# Altium schematic sheet Muxes_and_ADC.SchDoc: Multiplexers_and_ADC
size 431 x 279 mm; DrawnBy: Will Mensah; Organization: ORGANIZATION; Address1: ADDRESS 1; Address2: ADDRESS 2; Address3: ADDRESS 3; Address4: ADDRESS 4; Revision: -; SheetNumber: 4; SheetTotal: 6; ENG_APP_DATE: --/--/--; DSN_APP_DATE: --/--/--; CHK_APP_DATE: --/--/--
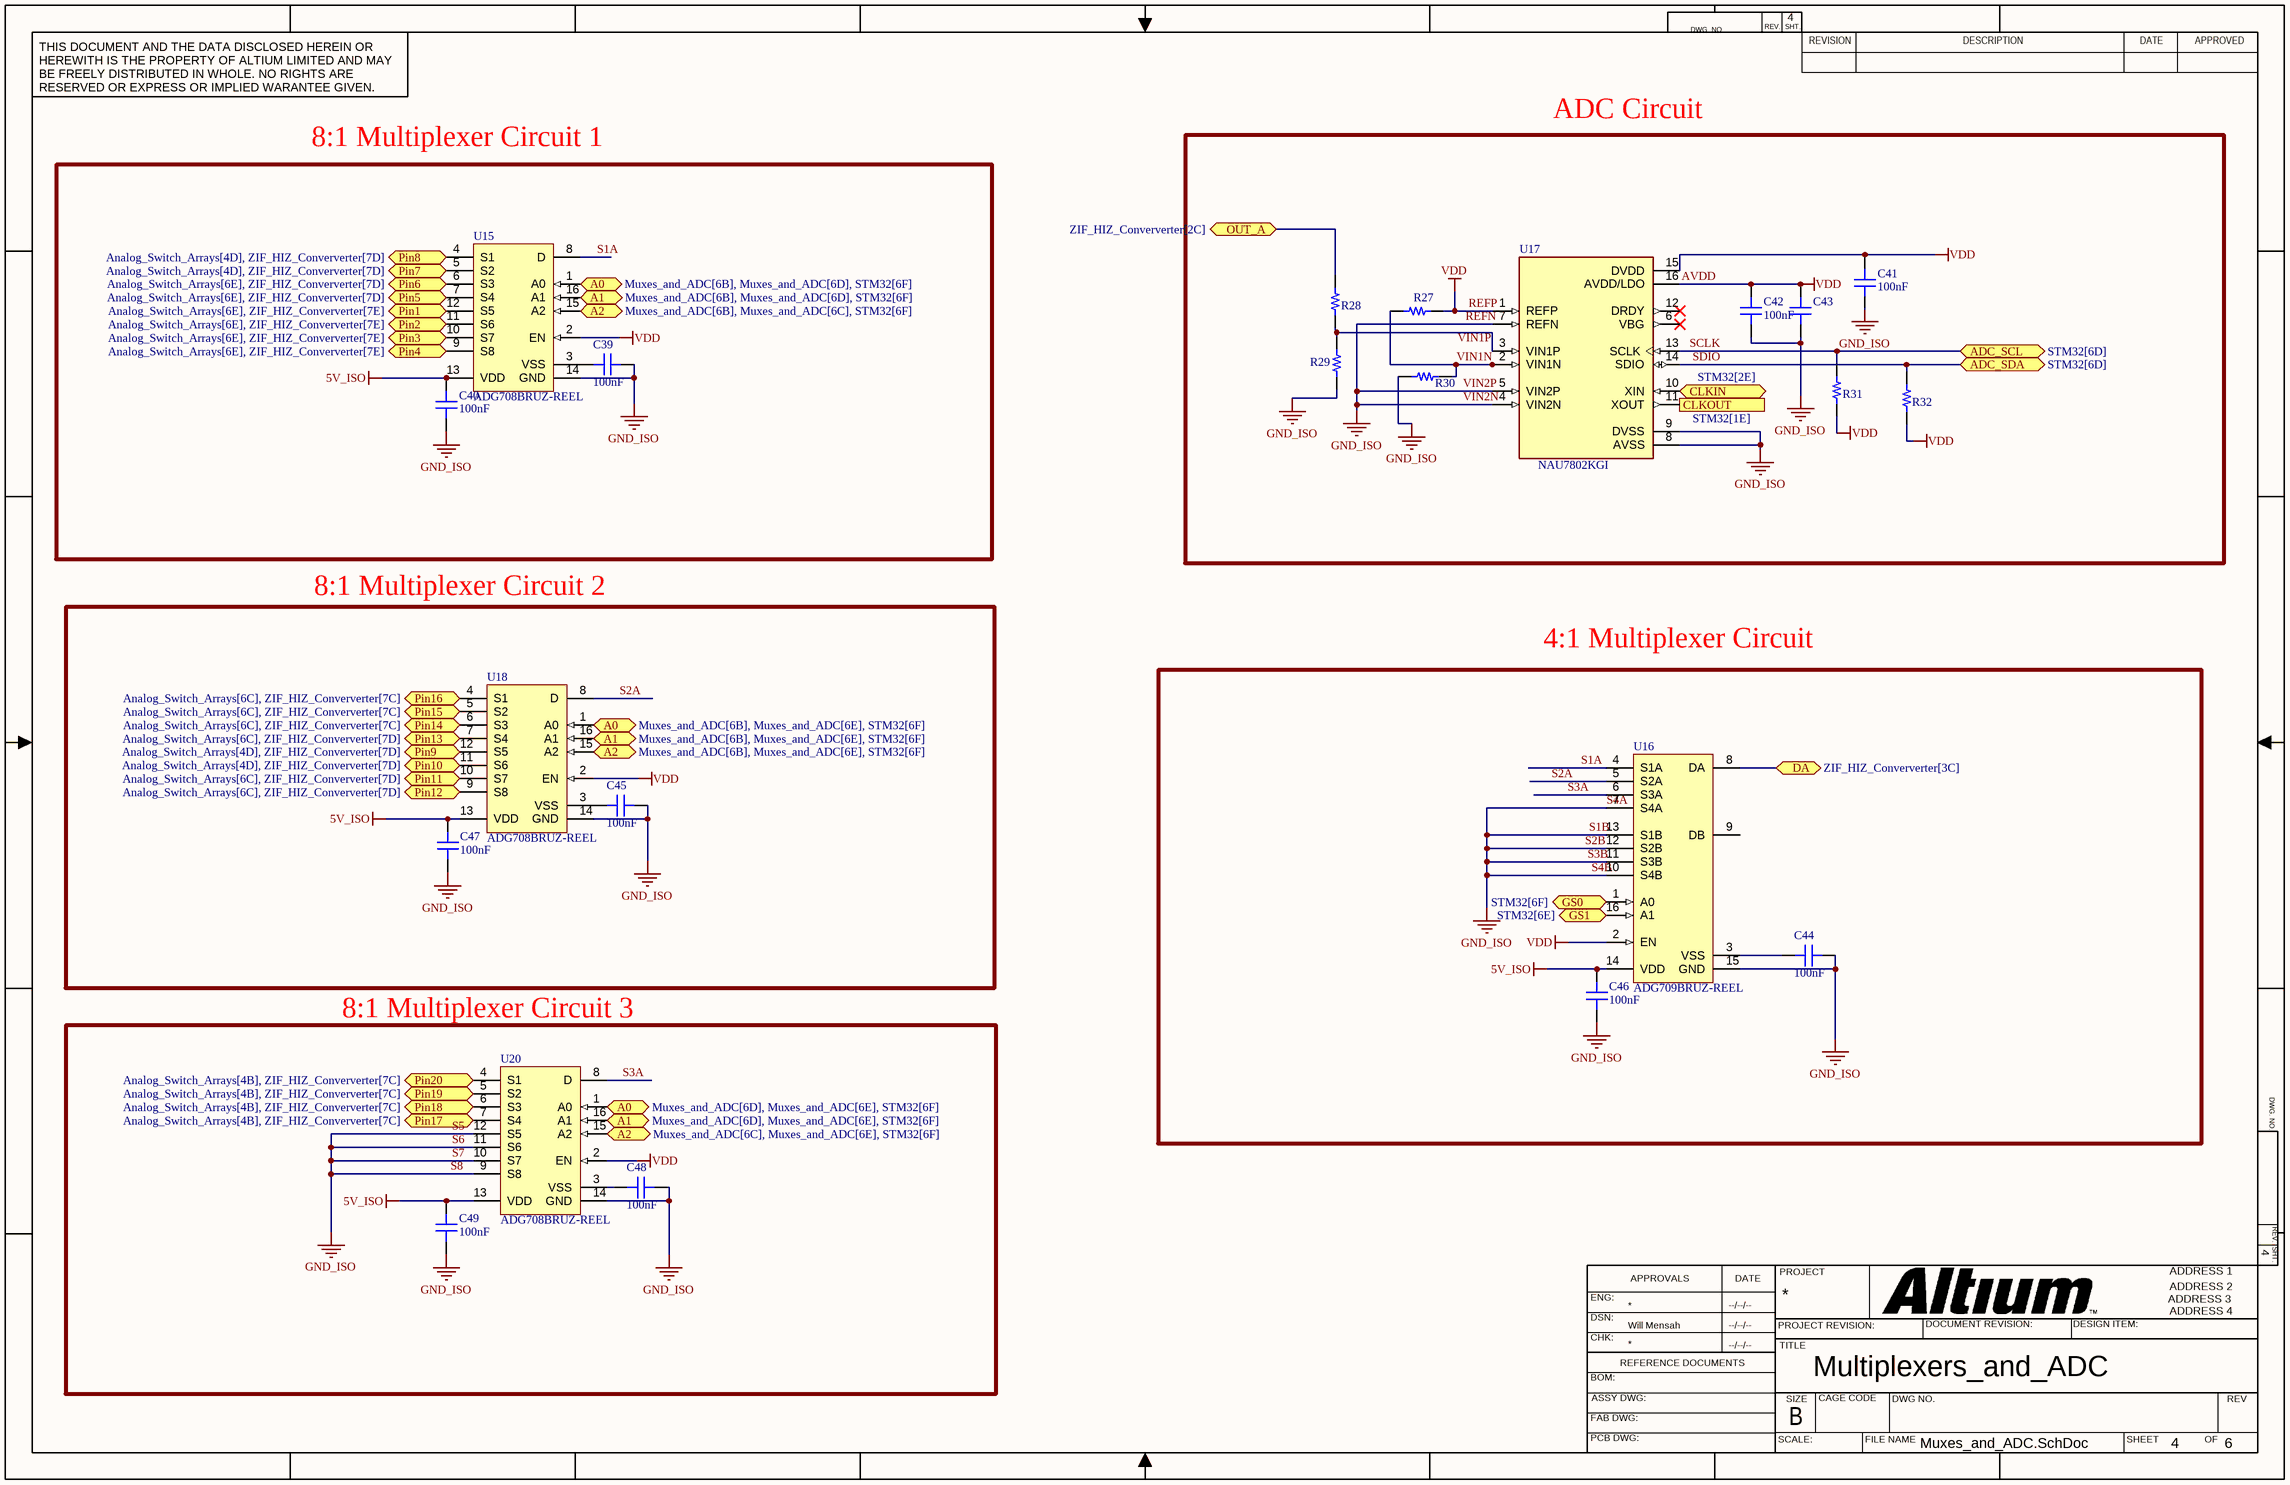
[diagram p0: Muxes_and_ADC.SchDoc]

## Parts
C39  value 100nF  [CAP 1206_3216 - 0.8MM]  (hidden comment: C1206X104G4HAC7800)
C40  value 100nF  [CAP 1206_3216 - 0.8MM]  (hidden comment: C1206X104G4HAC7800)
C41  value 100nF  [CAP 1206_3216 - 0.8MM]  (hidden comment: C1206X104G4HAC7800)
C42  value 100nF  [CAP 1206_3216 - 0.8MM]  (hidden comment: C1206X104G4HAC7800)
C43  C1206X104G4HAC7800  [CAP 1206_3216 - 0.8MM]  (value not drawn)
C44  value 100nF  [CAP 1206_3216 - 0.8MM]  (hidden comment: C1206X104G4HAC7800)
C45  value 100nF  [CAP 1206_3216 - 0.8MM]  (hidden comment: C1206X104G4HAC7800)
C46  value 100nF  [CAP 1206_3216 - 0.8MM]  (hidden comment: C1206X104G4HAC7800)
C47  value 100nF  [CAP 1206_3216 - 0.8MM]  (hidden comment: C1206X104G4HAC7800)
C48  value 100nF  [CAP 1206_3216 - 0.8MM]  (hidden comment: C1206X104G4HAC7800)
C49  value 100nF  [CAP 1206_3216 - 0.8MM]  (hidden comment: C1206X104G4HAC7800)
R27  TNPW120610K0BETY  [RES 1206_3216]  (value not drawn)
R28  TNPW120610K0BETY  [RES 1206_3216]  (value not drawn)
R29  TNPW120620K0BYEN  [RES 1206_3216]  (value not drawn)
R30  TNPW120610K0BETY  [RES 1206_3216]  (value not drawn)
R31  TNPW12064K70BEEA  [RES 1206_3216]  (value not drawn)
R32  TNPW12064K70BEEA  [RES 1206_3216]  (value not drawn)
U15  ADG708BRUZ-REEL  [ADI-RU-16_N]
U16  ADG709BRUZ-REEL  [ADI-RU-16_M]
U17  NAU7802KGI  [DIP792W45P254L1904H533Q16]
U18  ADG708BRUZ-REEL  [ADI-RU-16_N]
U20  ADG708BRUZ-REEL  [ADI-RU-16_N]

## Blocks framed on the sheet
8:1 Multiplexer Circuit 1: C39 C40 U15
ADC Circuit: C41-C43 R27-R32 U17
8:1 Multiplexer Circuit 2: C45 C47 U18
4:1 Multiplexer Circuit: C44 C46 U16
8:1 Multiplexer Circuit 3: C48 C49 U20

## Ports
A0 (bidir, see Muxes_and_ADC[6B], Muxes_and_ADC[6D], STM32[6F]), A0 (bidir, see Muxes_and_ADC[6B], Muxes_and_ADC[6E], STM32[6F]), A0 (bidir, see Muxes_and_ADC[6D], Muxes_and_ADC[6E], STM32[6F]), A1 (bidir, see Muxes_and_ADC[6B], Muxes_and_ADC[6D], STM32[6F]), A1 (bidir, see Muxes_and_ADC[6B], Muxes_and_ADC[6E], STM32[6F]), A1 (bidir, see Muxes_and_ADC[6D], Muxes_and_ADC[6E], STM32[6F]), A2 (bidir, see Muxes_and_ADC[6B], Muxes_and_ADC[6C], STM32[6F]), A2 (bidir, see Muxes_and_ADC[6B], Muxes_and_ADC[6E], STM32[6F]), A2 (bidir, see Muxes_and_ADC[6C], Muxes_and_ADC[6E], STM32[6F]), ADC_SCL (bidir, see STM32[6D]), ADC_SDA (bidir, see STM32[6D]), CLKIN (bidir, see STM32[2E]), CLKOUT (out, see STM32[1E]), DA (bidir, see ZIF_HIZ_Conververter[3C]), GS0 (bidir, see STM32[6F]), GS1 (bidir, see STM32[6E]), OUT_A (bidir, see ZIF_HIZ_Conververter[2C]), Pin1 (bidir, see Analog_Switch_Arrays[6E], ZIF_HIZ_Conververter[7E]), Pin2 (bidir, see Analog_Switch_Arrays[6E], ZIF_HIZ_Conververter[7E]), Pin3 (bidir, see Analog_Switch_Arrays[6E], ZIF_HIZ_Conververter[7E]), Pin4 (bidir, see Analog_Switch_Arrays[6E], ZIF_HIZ_Conververter[7E]), Pin5 (bidir, see Analog_Switch_Arrays[6E], ZIF_HIZ_Conververter[7D]), Pin6 (bidir, see Analog_Switch_Arrays[6E], ZIF_HIZ_Conververter[7D]), Pin7 (bidir, see Analog_Switch_Arrays[4D], ZIF_HIZ_Conververter[7D]), Pin8 (bidir, see Analog_Switch_Arrays[4D], ZIF_HIZ_Conververter[7D]), Pin9 (bidir, see Analog_Switch_Arrays[4D], ZIF_HIZ_Conververter[7D]), Pin10 (bidir, see Analog_Switch_Arrays[4D], ZIF_HIZ_Conververter[7D]), Pin11 (bidir, see Analog_Switch_Arrays[6C], ZIF_HIZ_Conververter[7D]), Pin12 (bidir, see Analog_Switch_Arrays[6C], ZIF_HIZ_Conververter[7D]), Pin13 (bidir, see Analog_Switch_Arrays[6C], ZIF_HIZ_Conververter[7D]), Pin14 (bidir, see Analog_Switch_Arrays[6C], ZIF_HIZ_Conververter[7C]), Pin15 (bidir, see Analog_Switch_Arrays[6C], ZIF_HIZ_Conververter[7C]), Pin16 (bidir, see Analog_Switch_Arrays[6C], ZIF_HIZ_Conververter[7C]), Pin17 (bidir, see Analog_Switch_Arrays[4B], ZIF_HIZ_Conververter[7C]), Pin18 (bidir, see Analog_Switch_Arrays[4B], ZIF_HIZ_Conververter[7C]), Pin19 (bidir, see Analog_Switch_Arrays[4B], ZIF_HIZ_Conververter[7C]), Pin20 (bidir, see Analog_Switch_Arrays[4B], ZIF_HIZ_Conververter[7C])

## Nets
5V_ISO: C40.2 C46.1 C47.1 C49.1 U15.13(VDD) U16.14(VDD) U18.13(VDD) U20.13(VDD)
AVDD: C41.1 C42.1 C43.1 R27.1 R31.1 R32.1 U15.2(EN) U16.2(EN) U17.1(REFP) U17.15(DVDD) U17.16(AVDD/LDO) U18.2(EN) U20.2(EN)  [also labelled REFP, VDD]
REFN: C39.1 C40.1 C41.2 C42.2 C43.2 C44.1 C45.1 C46.2 C47.2 C48.1 C49.2 R29.1 R30.2 U15.14(GND) U16.7(S4A) U16.10(S4B) U16.11(S3B) U16.12(S2B) U16.13(S1B) U16.15(GND) U17.4(VIN2N) U17.5(VIN2P) U17.7(REFN) U17.8(AVSS) U17.9(DVSS) U18.14(GND) U20.9(S8) U20.10(S7) U20.11(S6) U20.12(S5) U20.14(GND)  [also labelled GND_ISO, S1B, S2B, S3B, S4A, S4B, S5, S6, S7, S8, VIN2N, VIN2P]
A0: U15.1(A0) U18.1(A0) U20.1(A0) ; port A0
A1: U15.16(A1) U18.16(A1) U20.16(A1) ; port A1
A2: U15.15(A2) U18.15(A2) U20.15(A2) ; port A2
CLKIN: U17.10(XIN) ; port CLKIN
CLKOUT: U17.11(XOUT) ; port CLKOUT
DA: U16.8(DA) ; port DA
GS0: U16.1(A0) ; port GS0
GS1: U16.16(A1) ; port GS1
OUT_A: R28.2 ; port OUT_A
Pin1: U15.12(S5) ; port Pin1
Pin2: U15.11(S6) ; port Pin2
Pin3: U15.10(S7) ; port Pin3
Pin4: U15.9(S8) ; port Pin4
Pin5: U15.7(S4) ; port Pin5
Pin6: U15.6(S3) ; port Pin6
Pin7: U15.5(S2) ; port Pin7
Pin8: U15.4(S1) ; port Pin8
Pin9: U18.12(S5) ; port Pin9
Pin10: U18.11(S6) ; port Pin10
Pin11: U18.10(S7) ; port Pin11
Pin12: U18.9(S8) ; port Pin12
Pin13: U18.7(S4) ; port Pin13
Pin14: U18.6(S3) ; port Pin14
Pin15: U18.5(S2) ; port Pin15
Pin16: U18.4(S1) ; port Pin16
Pin17: U20.7(S4) ; port Pin17
Pin18: U20.6(S3) ; port Pin18
Pin19: U20.5(S2) ; port Pin19
Pin20: U20.4(S1) ; port Pin20
S1A: U15.8(D) U16.4(S1A)
S2A: U16.5(S2A) U18.8(D)
S3A: U16.6(S3A) U20.8(D)
SCLK: R31.2 U17.13(SCLK) ; port ADC_SCL
SDIO: R32.2 U17.14(SDIO) ; port ADC_SDA
VIN1N: R27.2 R30.1 U17.2(VIN1N)
NetC39_2: C39.2 U15.3(VSS)
NetC44_2: C44.2 U16.3(VSS)
NetC45_2: C45.2 U18.3(VSS)
NetC48_2: C48.2 U20.3(VSS)
NetR28_1: R28.1 R29.2 U17.3(VIN1P)

Not connected (* = marked no-connect by the designer): U16 9(DB); U17 6(VBG)* 12(DRDY)*

## Notes on the sheet
- Labels drawn without touching a wire or pin: VIN1P
- DWG. NO.
- REV.
- SHT.
- THIS DOCUMENT AND THE DATA DISCLOSED HEREIN OR HEREWITH IS THE PROPERTY OF ALTIUM LIMITED AND MAY BE FREELY DISTRIBUTED IN WHOLE. NO RIGHTS ARE RESERVED OR EXPRESS OR IMPLIED WARANTEE GIVEN.
- REVISION
- DESCRIPTION
- DATE
- APPROVED
- ENG:
- APPROVALS
- PROJECT
- DSN:
- CHK:
- REFERENCE DOCUMENTS
- PROJECT REVISION:
- TITLE
- DOCUMENT REVISION:
- DESIGN ITEM:
- BOM:
- FAB DWG:
- PCB DWG:
- ASSY DWG:
- SCALE:
- SIZE
- B
- CAGE CODE
- FILE NAME
- DWG NO.
- SHEET
- OF
- REV

## Library data of the parts
C39-C49 = CMP-001-063573-1: CAP CER 1206 0.1F 16V ULTRA STAB; Part Number: C1206X104G4HAC7800
R27 R28 R30 = CMP-009-078908-1: RES 10K OHM 0.1% 1/4W 1206; Part Number: TNPW120610K0BETY
R29 = CMP-009-083572-1: RES 20K OHM 0.1% 1/4W 1206; Part Number: TNPW120620K0BYEN
R31 R32 = CMP-009-078373-1: RES 4.7K OHM 0.1% 1/4W 1206; Part Number: TNPW12064K70BEEA
U15 U18 U20 = CMP-0798-00195-1: 1.8 to 5.5 V / +/-2.5 V, CMOS Low Voltage 3 Ohm, 8-Channel Multiplexer, -40 to 125 degC, 16-pin SOP (RU-16), Reel; Manufacturer: Analog Devices; t transition (s): 14n; Bandwidth (Hz): 55M; Supply V Guar Performance: Dual_(+/-2.5V), Single_(+3V), Single_(+5V); Ron (ohms): 3; Max Analog Signal Range: Vss to Vdd; ComponentLink1URL: http://www.analog.com/en/index.html; ComponentLink3Description: Package Specification; Code_JEDEC: MO-153AB; ComponentLink2URL: http://www.analog.com/static/imported-files/data_sheets/ADG708_709.pdf; Packing: Reel; ComponentLink3URL: http:/www.analog.com/static/imported-files/packages/36244347913743854010197452789RU16.pdf; PackageVersion: Nov-02; ComponentLink2Description: Datasheet; ComponentLink1Description: Manufacturer URL; PackageReference: RU-16; DatasheetVersion: Rev. C; PackageDescription: 16-Pin Thin Shrink Small Outline Package, Body 5 x 4.4 mm, Pitch 0.65 mm; PartNumber: ADG708BRUZ-REEL; Mounting Technology: Surface Mount
U16 = CMP-0798-00149-1: 1.8 to 5.5 V / +/-2.5 V, CMOS Low Voltage 3 Ohm, 4-Channel Multiplexer, -40 to 125 degC, 16-pin SOP (RU-16), Reel; Manufacturer: Analog Devices; Ron (ohms): 3; Supply V Guar Performance: Dual_(+/-2.5V), Single_(+3V), Single_(+5V); t transition (s): 14n; Max Analog Signal Range: Vss to Vdd; Bandwidth (Hz): 55M; Mounting Technology: Surface Mount; ComponentLink3URL: http:/www.analog.com/static/imported-files/packages/36244347913743854010197452789RU16.pdf; ComponentLink1Description: Manufacturer URL; PackageVersion: Nov-02; PackageDescription: 16-Pin Thin Shrink Small Outline Package, Body 5 x 4.4 mm, Pitch 0.65 mm; PartNumber: ADG709BRUZ-REEL; ComponentLink3Description: Package Specification; DatasheetVersion: Rev. C; ComponentLink2URL: http://www.analog.com/static/imported-files/data_sheets/ADG708_709.pdf; Code_JEDEC: MO-153AB; ComponentLink2Description: Datasheet; ComponentLink1URL: http://www.analog.com/en/index.html; PackageReference: RU-16; Packing: Reel
U17 = CMP-00256-1: 24 Bit Analog to Digital Converter 2 Input 1 Sigma-Delta 16-PDIP; MF: Nuvoton Technology Corporation of America; Component Type: Standard; Source: NAU7802KGI.SchLib; Design Item ID: NAU7802KGI; Package: Package; SnapEDA_Link: https://www.snapeda.com/parts/NAU7802KGI/Nuvoton/view-part/?ref=snap; Check_prices: https://www.snapeda.com/parts/NAU7802KGI/Nuvoton/view-part/?ref=eda; Value: *; MP: NAU7802KGI; Pin Count: 16